# Altium schematic sheet 03-mcu1.SchDoc: MCU
size Letter; DrawnBy: J. Brinton; Engineer: J. Brinton; Revision: 1; SheetNumber: 3; SheetTotal: 14
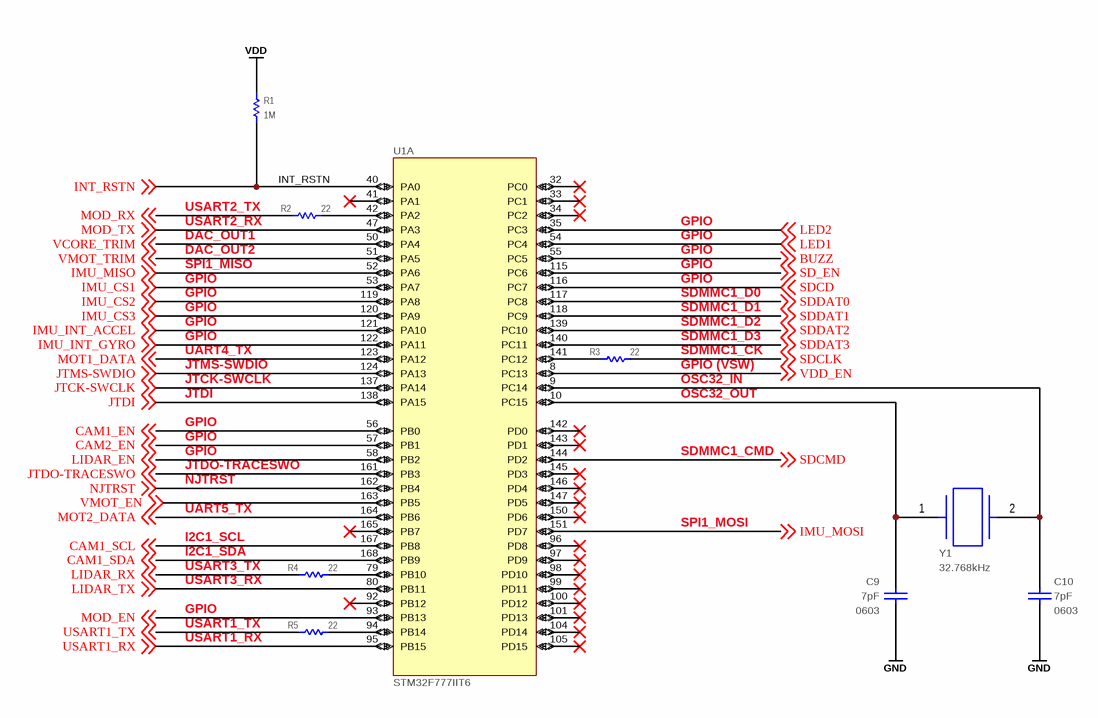
[diagram p0: 03-mcu1.SchDoc]

## Parts
C9  value 7pF  Package: 0603  [CAPC160X80X90L20N]  (hidden comment: CL10C070CB8NNNC)
C10  value 7pF  Package: 0603  [CAPC160X80X90L20N]  (hidden comment: CL10C070CB8NNNC)
R1  value 1M  [RESC2012X70N]  (hidden comment: ERJ-6ENF1004V)
R2  value 22  [RESC2012X70N]  (hidden comment: ERJ-6ENF22R0V)
R3  value 22  [RESC2012X70N]  (hidden comment: ERJ-6ENF22R0V)
R4  value 22  [RESC2012X70N]  (hidden comment: ERJ-6ENF22R0V)
R5  value 22  [RESC2012X70N]  (hidden comment: ERJ-6ENF22R0V)
U1  STM32F777IIT6  [TSQFP50P2600X2600X160-176N]  (part A of 4)
Y1  Frequency: 32.768kHz  [ABS07]  (hidden comment: ABS07-32.768KHZ-7)

## Nets
GND: C9.1 C10.1
VDD: R1.2
BUZZ: U1.55(PC5) ; off-sheet BUZZ
CAM1_EN: U1.56(PB0) ; off-sheet CAM1_EN
CAM1_SCL: U1.167(PB8) ; off-sheet CAM1_SCL
CAM1_SDA: U1.168(PB9) ; off-sheet CAM1_SDA
CAM2_EN: U1.57(PB1) ; off-sheet CAM2_EN
IMU_CS1: U1.53(PA7) ; off-sheet IMU_CS1
IMU_CS2: U1.119(PA8) ; off-sheet IMU_CS2
IMU_CS3: U1.120(PA9) ; off-sheet IMU_CS3
IMU_INT_ACCEL: U1.121(PA10) ; off-sheet IMU_INT_ACCEL
IMU_INT_GYRO: U1.122(PA11) ; off-sheet IMU_INT_GYRO
IMU_MISO: U1.52(PA6) ; off-sheet IMU_MISO
IMU_MOSI: U1.151(PD7) ; off-sheet IMU_MOSI
INT_RSTN: R1.1 U1.40(PA0) ; off-sheet INT_RSTN
JTCK-SWCLK: U1.137(PA14) ; off-sheet JTCK-SWCLK
JTDI: U1.138(PA15) ; off-sheet JTDI
JTDO-TRACESWO: U1.161(PB3) ; off-sheet JTDO-TRACESWO
JTMS-SWDIO: U1.124(PA13) ; off-sheet JTMS-SWDIO
LED1: U1.54(PC4) ; off-sheet LED1
LED2: U1.35(PC3) ; off-sheet LED2
LIDAR_EN: U1.58(PB2) ; off-sheet LIDAR_EN
LIDAR_RX: R4.2 ; off-sheet LIDAR_RX
LIDAR_TX: U1.80(PB11) ; off-sheet LIDAR_TX
MOD_EN: U1.93(PB13) ; off-sheet MOD_EN
MOD_RX: R2.2 ; off-sheet MOD_RX
MOD_TX: U1.47(PA3) ; off-sheet MOD_TX
MOT1_DATA: U1.123(PA12) ; off-sheet MOT1_DATA
MOT2_DATA: U1.164(PB6) ; off-sheet MOT2_DATA
NJTRST: U1.162(PB4) ; off-sheet NJTRST
SD_EN: U1.115(PC6) ; off-sheet SD_EN
SDCD: U1.116(PC7) ; off-sheet SDCD
SDCLK: R3.1 ; off-sheet SDCLK
SDCMD: U1.144(PD2) ; off-sheet SDCMD
SDDAT0: U1.117(PC8) ; off-sheet SDDAT0
SDDAT1: U1.118(PC9) ; off-sheet SDDAT1
SDDAT2: U1.139(PC10) ; off-sheet SDDAT2
SDDAT3: U1.140(PC11) ; off-sheet SDDAT3
USART1_RX: U1.95(PB15) ; off-sheet USART1_RX
USART1_TX: R5.2 ; off-sheet USART1_TX
VCORE_TRIM: U1.50(PA4) ; off-sheet VCORE_TRIM
VDD_EN: U1.8(PC13) ; off-sheet VDD_EN
VMOT_EN: U1.163(PB5) ; off-sheet VMOT_EN
VMOT_TRIM: U1.51(PA5) ; off-sheet VMOT_TRIM
NetC9_2: C9.2 U1.10(PC15) Y1.1(XTAL1)
NetC10_2: C10.2 U1.9(PC14) Y1.2(XTAL2)
NetR2_1: R2.1 U1.42(PA2)
NetR3_2: R3.2 U1.141(PC12)
NetR4_1: R4.1 U1.79(PB10)
NetR5_1: R5.1 U1.94(PB14)

Not connected (* = marked no-connect by the designer): U1 32(PC0)* 33(PC1)* 34(PC2)* 41(PA1)* 92(PB12)* 96(PD8)* 97(PD9)* 98(PD10)* 99(PD11)* 100(PD12)* 101(PD13)* 104(PD14)* 105(PD15)* 142(PD0)* 143(PD1)* 145(PD3)* 146(PD4)* 147(PD5)* 150(PD6)* 165(PB7)*

## Notes on the sheet
- (near R2) USART2_TX
- (near R2) USART2_RX
- DAC_OUT1
- DAC_OUT2
- GPIO
- SPI1_MISO
- SDMMC1_D0
- SDMMC1_D1
- SDMMC1_D2
- JTMS-SWDIO
- JTCK-SWCLK
- JTDI
- UART4_TX
- (near R3) SDMMC1_D3
- (near R3) SDMMC1_CK
- (near R3) GPIO (VSW)
- (near R3) OSC32_IN
- OSC32_OUT
- JTDO-TRACESWO
- SDMMC1_CMD
- NJTRST
- UART5_TX
- I2C1_SCL
- SPI1_MOSI
- USART3_TX
- USART3_RX
- I2C1_SDA
- USART1_TX
- USART1_RX
- Designed By:
- Title
- Engineer
- Revision
- Drawn By
- Date
- Sheet
- of

## Library data of the parts
C9 C10 = CAP: Ceramic Capacitor 7pF +/-0.25pF 0603; Manufacturer: Samsung; Tr: -55:125; Voltage: 50V; Manufacturer P/N: CL10C070CB8NNNC; Tolerance: +/-0.25pF
R1 = RES 0402: Thick Film Resistor 1M ±1% 0805; Manufacturer: Panasonic; Tr: -55:155; Package: 0805; Manufacturer P/N: ERJ-6ENF1004V; Tolerance: ±1%
R2-R5 = RES 0402: Thick Film Resistor 22 ±1% 0805; Manufacturer: Panasonic; Tr: -55:155; Package: 0805; Manufacturer P/N: ERJ-6ENF22R0V; Tolerance: ±1%
U1 = STM32F777IIT: Microcontroller; Manufacturer: STMicroelectronics; Manufacturer P/N: STM32F777IIT6
Y1 = ABS07-32.768KHZ-7: CRYSTAL 32.7680KHZ 7PF SMD; Manufacturer: Abracon LLC; Manufacturer P/N: ABS07-32.768KHZ-7-T; Operating Mode: Fundamental; Frequency Tolerance: ±20ppm; ESR (Equivalent Series Resistance): 70 kOhm; Size / Dimension: 0.126" L x 0.059" W (3.20mm x 1.50mm); Mounting Type: Surface Mount; Height: 0.035" (0.90mm); Package / Case: 2-SMD; Operating Temperature: -40°C ~ 85°C; Load Capacitance: 7pF; Type: kHz Crystal (Tuning Fork); RoHS: RoHS Compliant; ComponentLink1URL: http://www.abracon.com/Resonators/ABS07.pdf; ComponentLink1Description: Series Datasheet